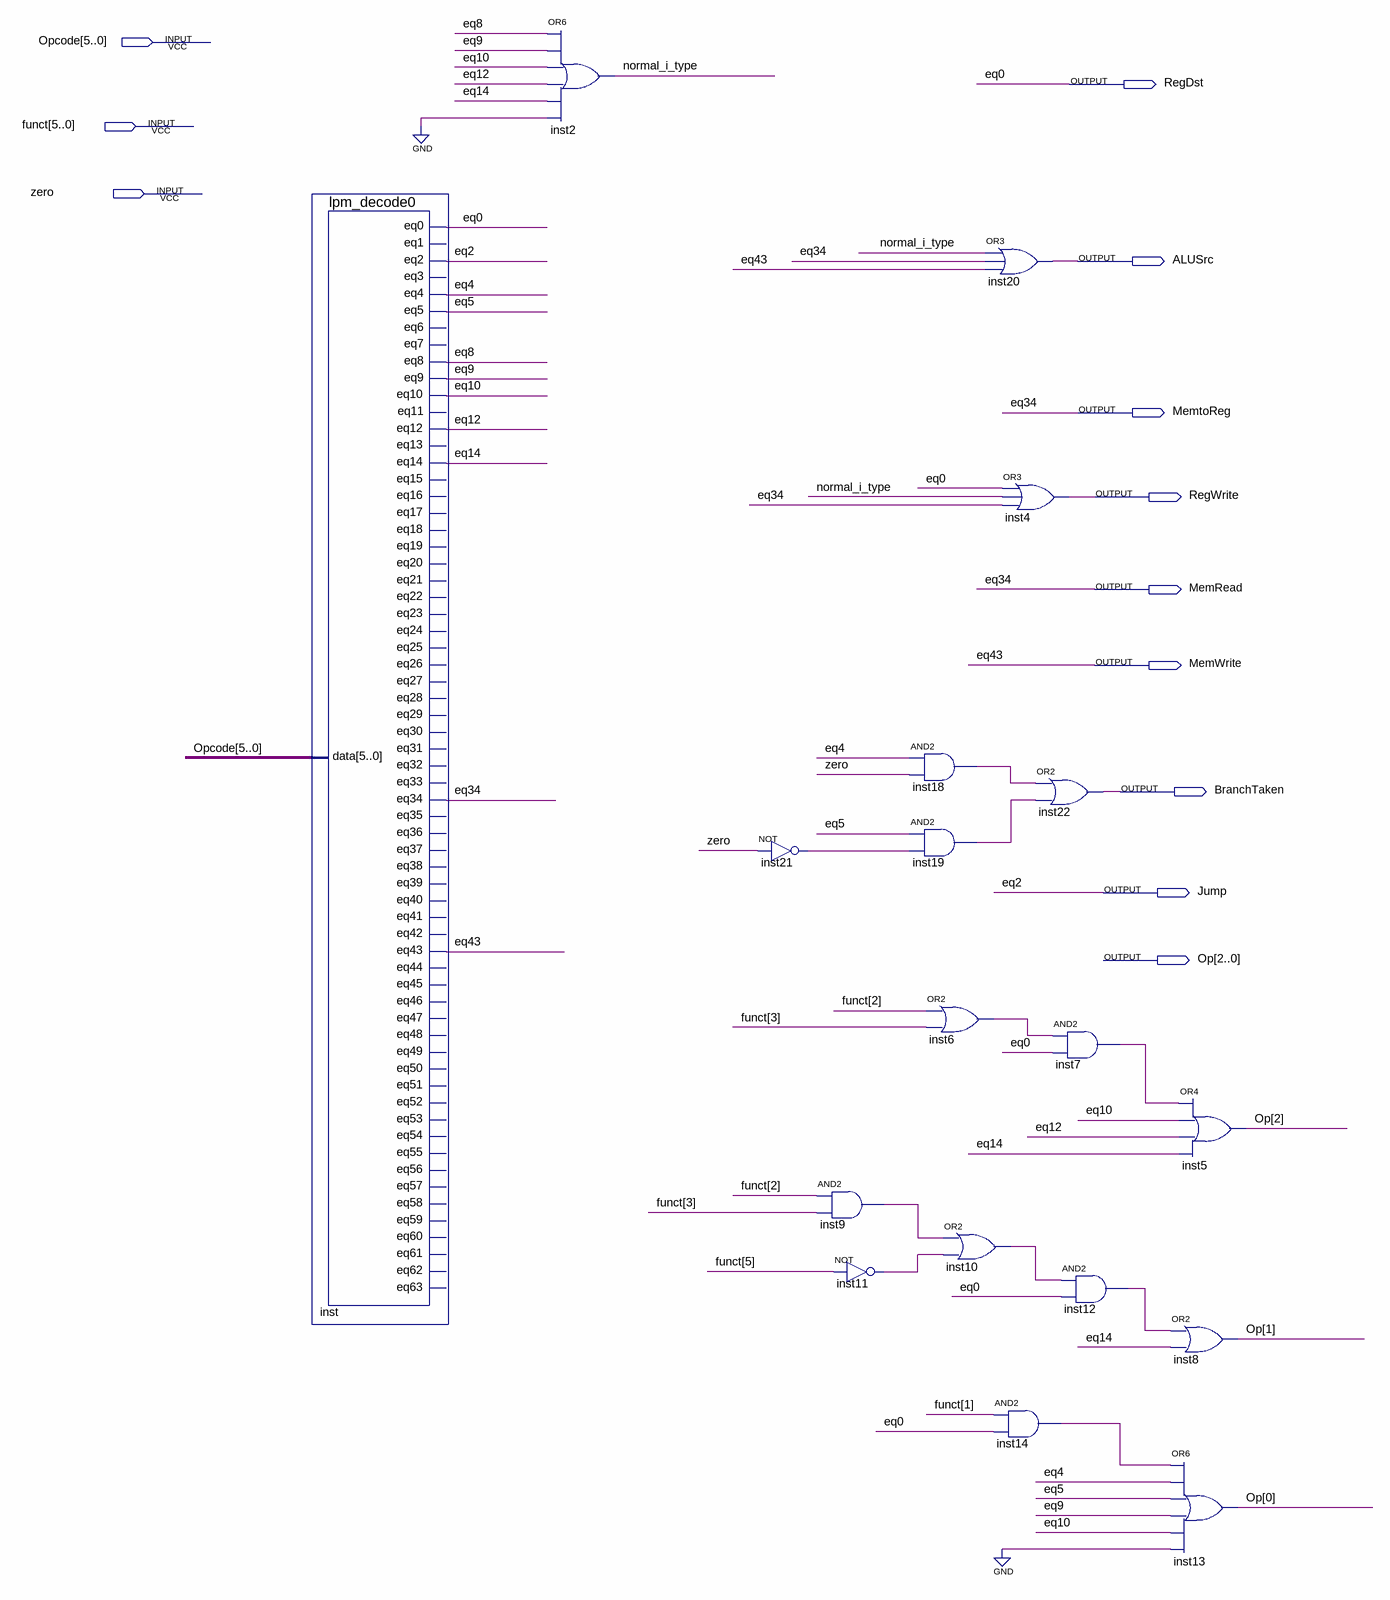
[diagram p0: schematic sheet]
// Quartus schematic controller.bdf as structural Verilog: 18 symbols, 12 pins
module controller (
  input  [5:0] Opcode,
  input  [5:0] funct,
  input  zero,
  output RegDst,
  output ALUSrc,
  output MemtoReg,
  output RegWrite,
  output MemRead,
  output MemWrite,
  output BranchTaken,
  output Jump,
  output [2:0] Op
);

  wire eq4, eq5, eq8, eq9, eq10, eq12, eq14, inst6_out, inst7_out, inst9_out, inst10_out, inst11_out,
       inst12_out, inst14_out, inst18_out, inst19_out, inst21_out, normal_i_type;

  lpm_decode0 inst (
    .data(Opcode), .eq0(RegDst), .eq2(Jump), .eq4(eq4), .eq5(eq5), .eq8(eq8), .eq9(eq9), .eq10(eq10),
    .eq12(eq12), .eq14(eq14), .eq34(MemRead), .eq43(MemWrite));  // open: eq1, eq3, eq6, eq7, eq11, eq13, eq15, eq16, eq17, eq18, eq19, eq20, eq21, eq22, eq23, eq24, eq25, eq26, eq27, eq28, eq29, eq30, eq31, eq32, eq33, eq35, eq36, eq37, eq38, eq39, eq40, eq41, eq42, eq44, eq45, eq46, eq47, eq48, eq49, eq50, eq51, eq52, eq53, eq54, eq55, eq56, eq57, eq58, eq59, eq60, eq61, eq62, eq63
  or inst2 (normal_i_type, eq8, eq9, eq10, eq12, eq14, 1'b0);
  not inst21 (inst21_out, zero);
  and inst9 (inst9_out, funct[2], funct[3]);
  not inst11 (inst11_out, funct[5]);
  and inst18 (inst18_out, eq4, zero);
  and inst19 (inst19_out, eq5, inst21_out);
  or inst6 (inst6_out, funct[2], funct[3]);
  or inst10 (inst10_out, inst9_out, inst11_out);
  or inst20 (ALUSrc, normal_i_type, MemRead, MemWrite);
  or inst4 (RegWrite, RegDst, normal_i_type, MemRead);
  or inst22 (BranchTaken, inst18_out, inst19_out);
  and inst14 (inst14_out, funct[1], RegDst);
  and inst7 (inst7_out, inst6_out, RegDst);
  and inst12 (inst12_out, inst10_out, RegDst);
  or inst8 (Op[1], inst12_out, eq14);
  or inst13 (Op[0], inst14_out, eq4, eq5, eq9, eq10, 1'b0);
  or inst5 (Op[2], inst7_out, eq10, eq12, eq14);

  assign MemtoReg = MemRead;

  // Other names for the same wires on the sheet: eq0 = RegDst; eq2 = Jump; eq34 = MemRead; eq43 = MemWrite
endmodule
